# Altium schematic sheet super.SchDoc
size A4
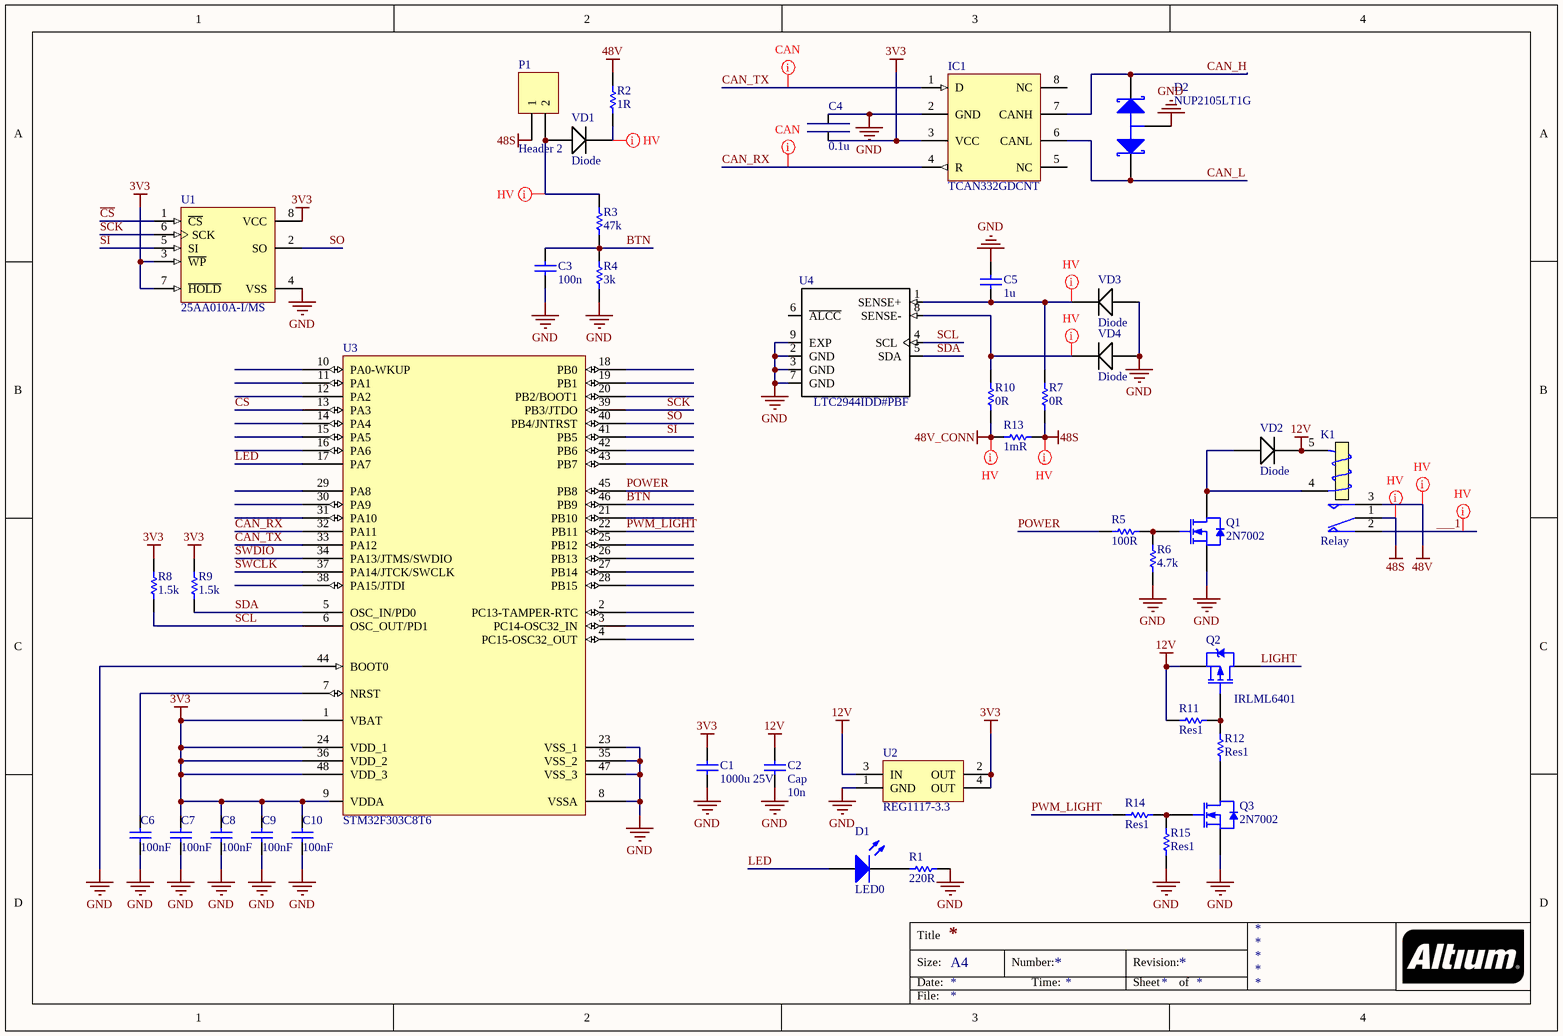
[diagram p0: super.SchDoc]

## Parts
C1  1000u 25V  [RR_B]
C2  Cap  value 10n  [0603x]
C3  100n  [0603x]
C4  0.1u  [CAPC1608X08N(0603)]
C5  1u  [0603x]
C6  value 100nF  [0603x]  (hidden comment: Cap)
C7  value 100nF  [0603x]  (hidden comment: Cap)
C8  value 100nF  [0603x]  (hidden comment: Cap)
C9  value 100nF  [0603x]  (hidden comment: Cap)
C10  value 100nF  [0603x]  (hidden comment: Cap)
D1  LED0  [HDR1X2]
D2  NUP2105LT1G  [SOT-23_M]
IC1  TCAN332GDCNT  [SOT23-8_L]
K1  Relay  [RELAY_12V_MICRO]
P1  Header 2  [HDR1X2]
Q1  2N7002  [SOT23_N]
Q2  IRLML6401  [Micro3_N]
Q3  2N7002  [SOT23_N]
R1  220R  [0603x]
R2  1R  [2512]
R3  47k  [0603x]
R4  3k  [0603x]
R5  100R  [0603x]
R6  4.7k  [0603x]
R7  0R  [0603x]
R8  1.5k  [0603x]
R9  1.5k  [0603x]
R10  0R  [0603x]
R11  Res1  [0603x]
R12  Res1  [0603x]
R13  1mR  [2512]
R14  Res1  [0603x]
R15  Res1  [0603x]
U1  25AA010A-I/MS  [SO-8_N]
U2  REG1117-3.3  [SOt-223_L]
U3  STM32F303C8T6  [LQFP48_N]
U4  LTC2944IDD#PBF  [SON300X300X80-9N]
VD1  Diode  [SOD-80/MLL34]
VD2  Diode  [SOD-80/MLL34]
VD3  Diode  [SMB_real]
VD4  Diode  [SMB_real]

## Nets
3V3: C1.1 C4.2 C7.2 C8.2 C9.2 C10.2 IC1.3(VCC) R8.2 R9.2 U1.3(~{WP}) U1.7(~{HOLD}) U1.8(VCC) U2.2(OUT) U2.4(OUT) U3.1(VBAT) U3.9(VDDA) U3.24(VDD_1) U3.36(VDD_2) U3.48(VDD_3)
12V: C2.1 K1.5(T2) Q2.2(S) R11.1 U2.3(IN) VD2.2(K)
48S: K1.1(COM) P1.1 R7.2 R13.2
48V: K1.3(NO) R2.2
48V_CONN: R10.2 R13.1
GND: C1.2 C2.2 C3.2 C4.1 C5.2 C6.1 C7.1 C8.1 C9.1 C10.1 D2.3(A) IC1.2(GND) Q1.2(S) Q3.2(S) R1.2 R4.1 R6.1 R15.1 U1.4(VSS) U2.1(GND) U3.8(VSSA) U3.23(VSS_1) U3.35(VSS_2) U3.44(BOOT0) U3.47(VSS_3) U4.2(GND) U4.3(GND) U4.7(GND) U4.9(EXP) VD3.1(A) VD4.1(A)
___1: K1.2(NC)
BTN: C3.1 R3.1 R4.2 U3.46(PB9)
~{CS}: U1.1(~{CS}) U3.13(PA3)
CAN_H: D2.1(K1) IC1.7(CANH)
CAN_L: D2.2(K2) IC1.6(CANL)
CAN_RX: IC1.4(R) U3.32(PA11)
CAN_TX: IC1.1(D) U3.33(PA12)
LED: D1.1(A) U3.17(PA7)
LIGHT: Q2.3(D)
POWER: R5.1 U3.45(PB8)
PWM_LIGHT: R14.1 U3.22(PB11)
SCK: U1.6(SCK) U3.39(PB3/JTDO)
SCL: R8.1 U3.6(OSC_OUT/PD1) U4.4(SCL)
SDA: R9.1 U3.5(OSC_IN/PD0) U4.5(SDA)
SI: U1.5(SI) U3.41(PB5)
SO: U1.2(SO) U3.40(PB4/JNTRST)
SWCLK: U3.37(PA14/JTCK/SWCLK)
SWDIO: U3.34(PA13/JTMS/SWDIO)
NetC5_1: C5.1 R7.1 U4.1(SENSE+) VD3.2(K)
NetC6_2: C6.2 U3.7(NRST)
NetD1_2: D1.2(K) R1.1
NetK1_4: K1.4(T1) Q1.3(D) VD2.1(A)
NetP1_2: P1.2 R3.2 VD1.1(A)
NetQ1_1: Q1.1(G) R5.2 R6.2
NetQ2_1: Q2.1(G) R11.2 R12.1
NetQ3_1: Q3.1(G) R14.2 R15.2
NetQ3_3: Q3.3(D) R12.2
NetR2_1: R2.1 VD1.2(K)
NetR10_1: R10.1 U4.8(SENSE-) VD4.2(K)

Not connected (* = marked no-connect by the designer): IC1 5(NC) 8(NC); U3 2(PC13-TAMPER-RTC) 3(PC14-OSC32_IN) 4(PC15-OSC32_OUT) 10(PA0-WKUP) 11(PA1) 12(PA2) 14(PA4) 15(PA5) 16(PA6) 18(PB0) 19(PB1) 20(PB2/BOOT1) 21(PB10) 25(PB12) 26(PB13) 27(PB14) 28(PB15) 29(PA8) 30(PA9) 31(PA10) 38(PA15/JTDI) 42(PB6) 43(PB7); U4 6(~{ALCC})

## Layout directives
net class CAN: CAN_RX, CAN_TX
net class HV: 48S, 48V, 48V_CONN, ___1, NetC5_1, NetP1_2, NetR2_1, NetR10_1

## Notes on the sheet
- Title
- Size:
- Date:
- A4
- Number:
- Time:
- Revision:
- Sheet
- of
- File:

## Library data of the parts
C1 = Cap: Capacitor; Value: 100pF; Published: 8-Jun-2000; LatestRevisionDate: 17-Jul-2002; LatestRevisionNote: Re-released for DXP Platform.; PackageReference: RAD-0.3; Publisher: Altium Limited; PackageDescription: Radial Cap, Thru-Hole; 2 Leads; 0.3 in Pin Spacing
C2 C6-C10 = Cap: Capacitor; Published: 8-Jun-2000; LatestRevisionDate: 17-Jul-2002; LatestRevisionNote: Re-released for DXP Platform.; PackageReference: RAD-0.3; Publisher: Altium Limited; PackageDescription: Radial Cap, Thru-Hole; 2 Leads; 0.3 in Pin Spacing
C3 C5 = Cap: Capacitor; Value: 10n; Published: 8-Jun-2000; LatestRevisionDate: 17-Jul-2002; LatestRevisionNote: Re-released for DXP Platform.; PackageReference: RAD-0.3; Publisher: Altium Limited; PackageDescription: Radial Cap, Thru-Hole; 2 Leads; 0.3 in Pin Spacing
C4 = Ceramic Chip Capacitor: Value: CAP CER 0.1UF 50V X7R 0603; Order Number: 06035C104KAT2A; Distributor: AVX Corporation; Package: 0603
D1 = LED0: Typical INFRARED GaAs LED; Published: 8-Jun-2000; LatestRevisionDate: 08-Jul-2005; LatestRevisionNote: Mech Layer 1 removed.; PackageReference: LED-0; Publisher: Altium Limited; PackageDescription: LED; 2 Leads
D2 = BAT54A: Schottky Barrier Double Diode; LatestRevisionNote: IPC-7351 Footprint Added.; Package: SOT23; PackageDescription: 3-Pin SOT-23 Package 0.95 mm Pitch, 2.3 mm Lead Span; ComponentLink1Description: Manufacturer Link; ComponentLink1URL: http://www.semiconductors.philips.com/; Value: NUP2105LT1G; Distributor: ON Semiconductor; Order Number: NUP2105LT1G
K1 = Relay: SPDT Relay; Published: 8-Jun-2000; LatestRevisionDate: 17-Jul-2002; LatestRevisionNote: Re-released for DXP Platform.; PackageReference: MODULE5B; Publisher: Altium Limited
P1 = Header 2: Header, 2-Pin; LatestRevisionDate: 17-Jul-2002; LatestRevisionNote: Re-released for DXP Platform.; Publisher: Altium Limited
Q1 Q3 = 2N7002: N-channel Enhancement Mode Field-effect Transistor; Published: 17-Sep-2003; LatestRevisionDate: 12-Dec-2006; LatestRevisionNote: IPC-7351 Footprint Added.; DatasheetVersion: 27-Jul-2000; PackageVersion: May-1999; PackageReference: SOT23; Publisher: Altium Limited; PackageDescription: 3-Pin SOT-23 Package 0.95 mm Pitch, 2.3 mm Lead Span; ComponentLink1Description: Manufacturer Link; ComponentLink1URL: http://www.semiconductors.philips.com/; ComponentLink2Description: Datasheet; ComponentLink2URL: http://www.semiconductors.philips.com/acrobat/datasheets/2N7002_4.pdf
Q2 = IRLML6401: HEXFET Power MOSFET; Published: 17-Sep-2003; DatasheetVersion: 2-Jul-2001; PackageVersion: Jul-2001; PackageReference: Micro3; Publisher: Altium Limited; PackageDescription: 3-Pin SOT-23 Package 0.95 mm Pitch, 2.3 mm Lead Span; ComponentLink1Description: Manufacturer Link; ComponentLink1URL: http://www.irf.com/; ComponentLink2Description: Datasheet; ComponentLink2URL: http://www.irf.com/product-info/datasheets/data/IRLML6401.pdf
R1 R5-R12 R14 R15 = Res1: Resistor; Value: 1K; Published: 8-Jun-2000; LatestRevisionDate: 17-Jul-2002; LatestRevisionNote: Re-released for DXP Platform.; PackageReference: AXIAL-0.3; Publisher: Altium Limited; PackageDescription: Axial Device, Thru-Hole; 2 Leads; 0.3 in Pin Spacing
R2 = Res1: Resistor; Published: 8-Jun-2000; LatestRevisionDate: 17-Jul-2002; LatestRevisionNote: Re-released for DXP Platform.; PackageReference: AXIAL-0.3; Publisher: Altium Limited; PackageDescription: Axial Device, Thru-Hole; 2 Leads; 0.3 in Pin Spacing; Value: 1R
R3 R4 = Res1: Resistor; Value: 18k; Published: 8-Jun-2000; LatestRevisionDate: 17-Jul-2002; LatestRevisionNote: Re-released for DXP Platform.; PackageReference: AXIAL-0.3; Publisher: Altium Limited; PackageDescription: Axial Device, Thru-Hole; 2 Leads; 0.3 in Pin Spacing
R13 = Res1: Resistor; Value: 10mR; Published: 8-Jun-2000; LatestRevisionDate: 17-Jul-2002; LatestRevisionNote: Re-released for DXP Platform.; PackageReference: AXIAL-0.3; Publisher: Altium Limited; PackageDescription: Axial Device, Thru-Hole; 2 Leads; 0.3 in Pin Spacing
U1 = 25AA010A-I/MS: 1K SPI Bus Serial EEPROM, 8-Pin MSOP, Industrial Temperature; Published: 29-Jan-2009; LatestRevisionDate: 02-Dec-2009; LatestRevisionNote: Updated to datasheet revision E, Jan-2008; DatasheetVersion: revE, Sep-2008; PackageVersion: revBB, Aug-2009; PackageReference: MSOP-MS8; Publisher: Altium Limited; PackageDescription: 8-Lead Plastic Micro Small Outline Package (MS) [MSOP]; Supplier 1: Digi-Key; Supplier Part Number 1: 25AA010A-I/MS-ND; Supplier 2: Farnell; Supplier Part Number 2: 1331337; ComponentLink1Description: Datasheet; ComponentLink1URL: http://ww1.microchip.com/downloads/en/DeviceDoc/21832E.pdf; ComponentLink2Description: Packaging Specification; ComponentLink2URL: http://www.microchip.com/stellent/groups/techpub_sg/documents/packagingspec/en012702.pdf; ComponentLink3Description: Microchip.com Home; ComponentLink3URL: http://www.microchip.com/
U2 = REG1117-3.3: 800mA and 1A Low Dropout Positive Regulator 2.85V, 3.3V, 5V, and Adjustable; Published: 8-Jun-2000; LatestRevisionDate: 17-Jul-2002; LatestRevisionNote: Re-released for DXP Platform.; DatasheetVersion: Sep-1997; PackageVersion: revC; PackageReference: ZZ311; Publisher: Altium Limited; PackageDescription: SOT-223/SC-73; 4 Leads; Body 6.7 x 7.3 mm, inc. leads (LxW max); ComponentLink1Description: Manufacturer Link; ComponentLink1URL: http://www.ti.com/; ComponentLink2Description: Datasheet; ComponentLink2URL: http://www-s.ti.com/sc/ds/REG1117.pdf
U3 = STM32F103C6T6: STM32 ARM-based 32-bit MCU with 32 Kbytes Flash, 48-pin LQFP, Industrial Temperature; Published: 30-May-2008; DatasheetVersion: rev6, Mar-2008; PackageVersion: Mar-2008; PackageReference: LQFP48; Publisher: Altium Limited; PackageDescription: 48-Pin Low-Profile Quad Flat Pack, 7 x 7 mm Body, 0.5 mm Pitch (LQFP48); ComponentLink1Description: Manufacturer Link; ComponentLink1URL: www.st.com/stm32; ComponentLink2Description: Datasheet; ComponentLink2URL: http://www.st.com/stonline/products/literature/ds/13587.pdf
U4 = LTC2944IDD#PBF: LTC2944 - 60V Battery Gas Gauge with Temperature, Voltage and Current Measurement; MF: Linear Technology; SnapEDA_Link: https://www.snapeda.com/parts/LTC2944IDD%2523PBF/Linear%2520Technology/view-part/?ref=snap; Availability: Bad; MP: LTC2944IDD#PBF; Price: 5.13 USD; Package: DFN-8 Linear Technology; Value: *
VD1-VD4 = Diode: Default Diode; Published: 8-Jun-2000; LatestRevisionDate: 17-Jul-2002; LatestRevisionNote: Re-released for DXP Platform.; PackageVersion: Sep-1996; PackageReference: SMC; Publisher: Altium Limited; PackageDescription: DO-214-AB/SMC; 2 C-Bend Leads; Body 7.9 x 5.9 mm, inc. leads (LxW); Code_JEDEC: DO-214-AB
IC1 = TCAN332GDCNT: Order Number: TCAN332GDCNT; Package: SOT23-8; Value: TCAN332GDCNT; Distributor: Texas Instruments